# Altium project fotel_color.PrjPCB
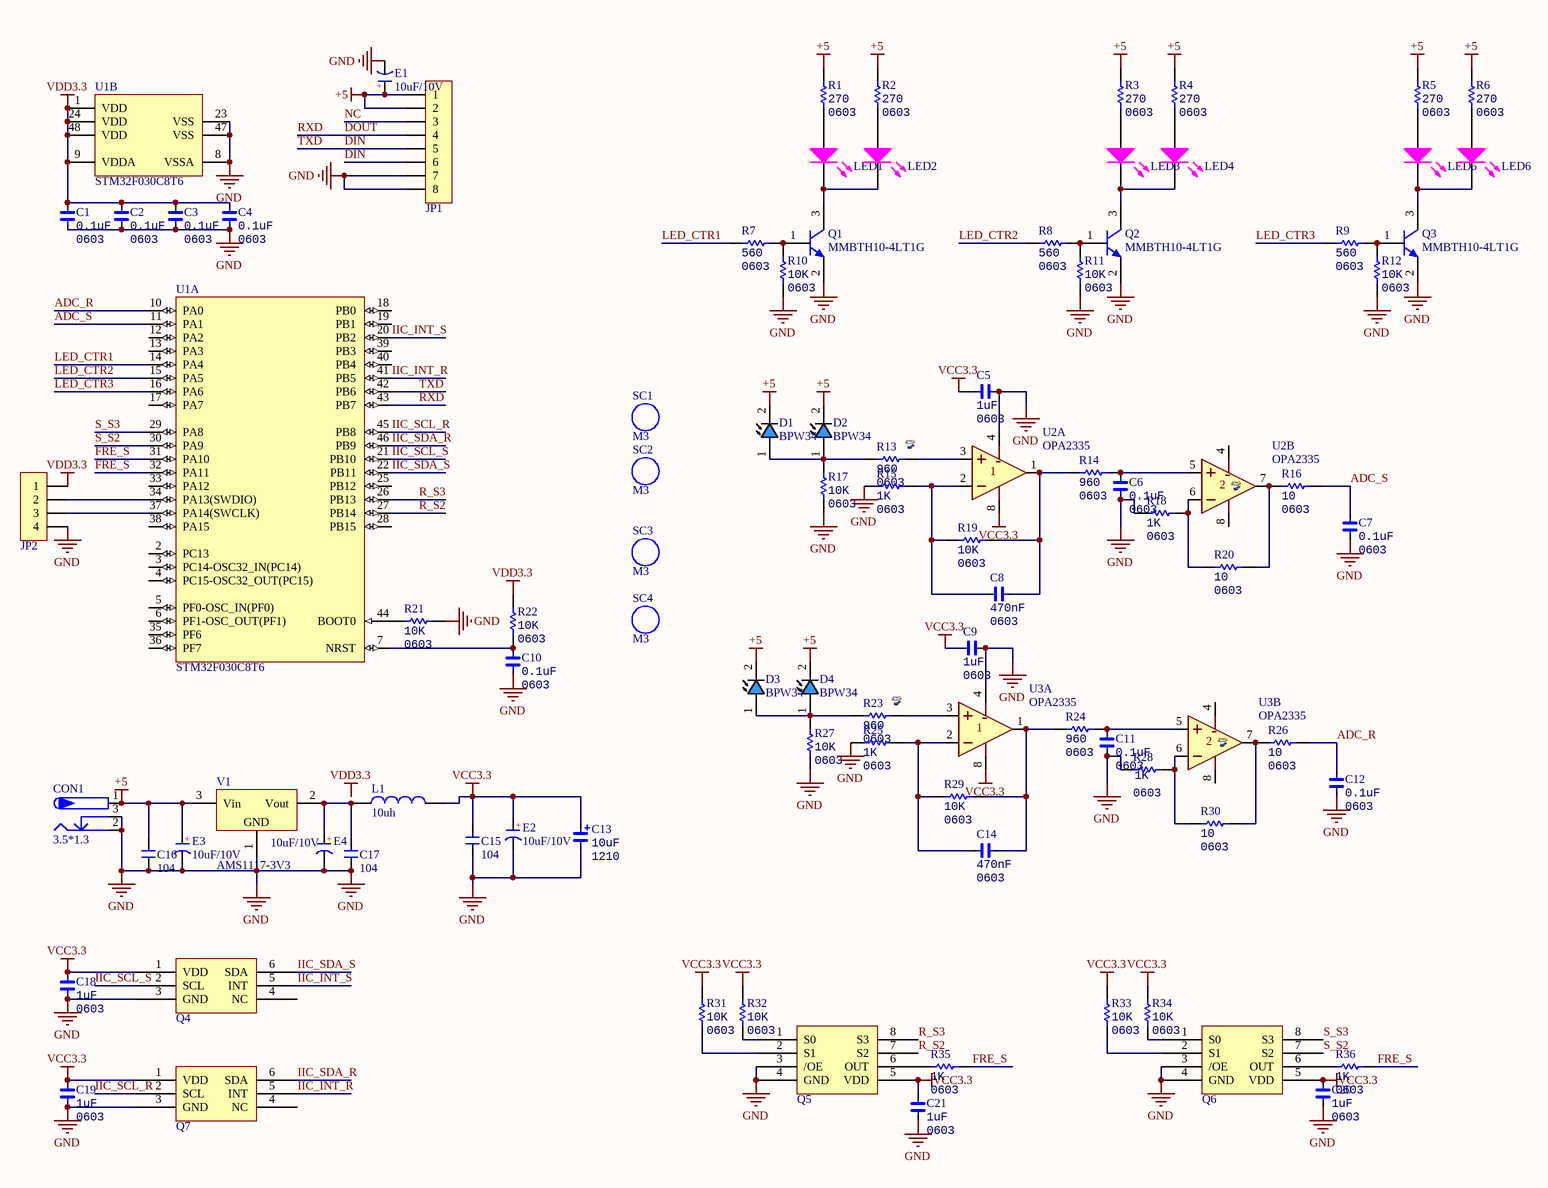
[diagram p0: fotel_color.SchDoc]
1 sheet, 90 parts. Net scope: global (net labels, ports and power ports of the same name join across sheets).
Board file: fotel_color.PcbDoc

## Sheet fotel_color.SchDoc
size A3

### Parts
C1  value 0.1uF  Type: 0603  [CAP_0603]  (hidden comment: C0402)
C2  value 0.1uF  Type: 0603  [CAP_0603]  (hidden comment: C0402)
C3  value 0.1uF  Type: 0603  [CAP_0603]  (hidden comment: C0402)
C4  value 0.1uF  Type: 0603  [CAP_0603]  (hidden comment: C0402)
C5  value 1uF  Type: 0603  [CAP_0603]  (hidden comment: C0402)
C6  value 0.1uF  Type: 0603  [CAP_0603]  (hidden comment: C0402)
C7  value 0.1uF  Type: 0603  [CAP_0603]  (hidden comment: C0402)
C8  value 470nF  Type: 0603  [CAP_0603]  (hidden comment: C0402)
C9  value 1uF  Type: 0603  [CAP_0603]  (hidden comment: C0402)
C10  value 0.1uF  Type: 0603  [CAP_0603]  (hidden comment: C0402)
C11  value 0.1uF  Type: 0603  [CAP_0603]  (hidden comment: C0402)
C12  value 0.1uF  Type: 0603  [CAP_0603]  (hidden comment: C0402)
C13  value 10uF  Type: 1210  [CAP_TAN_B1210]  (hidden comment: C1210)
C14  value 470nF  Type: 0603  [CAP_0603]  (hidden comment: C0402)
C15  104  [C 0603]
C16  104  [C 0603]
C17  104  [C 0603]
C18  value 1uF  Type: 0603  [CAP_0603]  (hidden comment: C0402)
C19  value 1uF  Type: 0603  [CAP_0603]  (hidden comment: C0402)
C20  value 1uF  Type: 0603  [CAP_0603]  (hidden comment: C0402)
C21  value 1uF  Type: 0603  [CAP_0603]  (hidden comment: C0402)
CON1  3.5*1.3  [DC-005]
D1  BPW34  [TEMD5510]
D2  BPW34  [CLS15]
D3  BPW34  [TEMD5510]
D4  BPW34  [CLS15]
E1  10uF/10V  [CM D(6.3*5.4)]
E2  10uF/10V  [CM D(6.3*5.4)]
E3  10uF/10V  [CM D(6.3*5.4)]
E4  10uF/10V  [CM D(6.3*5.4)]
JP1  HDR-1X8  [PH2.0 S-W-8P]  (value not drawn)
JP2  HDR-1X4  [XH2.54-4P]  (value not drawn)
L1  10uh  [L 0603]
LED1  LED-3-R  [LED-R3-H5-SINGLE-R]  (value not drawn)
LED2  LED-3-R  [LED-R3-H5-SINGLE-R]  (value not drawn)
LED3  LED-3-R  [LED-R3-H5-SINGLE-R]  (value not drawn)
LED4  LED-3-R  [LED-R3-H5-SINGLE-R]  (value not drawn)
LED5  LED-3-R  [LED-R3-H5-SINGLE-R]  (value not drawn)
LED6  LED-3-R  [LED-R3-H5-SINGLE-R]  (value not drawn)
Q1  MMBTH10-4LT1G  [ONSC-SOT-23-3-318-08_V]
Q2  MMBTH10-4LT1G  [ONSC-SOT-23-3-318-08_V]
Q3  MMBTH10-4LT1G  [ONSC-SOT-23-3-318-08_V]
Q4  (no value)  [TCS34725]
Q5  (no value)  [SOP-8]
Q6  (no value)  [SOP-8]
Q7  (no value)  [TCS34725]
R1  Type: 0603  [RES_0603]  (hidden comment: 270)
R2  Type: 0603  [RES_0603]  (hidden comment: 270)
R3  Type: 0603  [RES_0603]  (hidden comment: 270)
R4  Type: 0603  [RES_0603]  (hidden comment: 270)
R5  Type: 0603  [RES_0603]  (hidden comment: 270)
R6  Type: 0603  [RES_0603]  (hidden comment: 270)
R7  Type: 0603  [RES_0603]  (hidden comment: 560)
R8  Type: 0603  [RES_0603]  (hidden comment: 560)
R9  Type: 0603  [RES_0603]  (hidden comment: 560)
R10  Type: 0603  [RES_0603]  (hidden comment: 10K)
R11  Type: 0603  [RES_0603]  (hidden comment: 10K)
R12  Type: 0603  [RES_0603]  (hidden comment: 10K)
R13  Type: 0603  [RES_0603]  (hidden comment: 960)
R14  Type: 0603  [RES_0603]  (hidden comment: 960)
R15  Type: 0603  [RES_0603]  (hidden comment: 1K)
R16  Type: 0603  [RES_0603]  (hidden comment: 10)
R17  Type: 0603  [RES_0603]  (hidden comment: 10K)
R18  Type: 0603  [RES_0603]  (hidden comment: 1K)
R19  Type: 0603  [RES_0603]  (hidden comment: 10K)
R20  Type: 0603  [RES_0603]  (hidden comment: 10)
R21  Type: 0603  [RES_0603]  (hidden comment: 10K)
R22  Type: 0603  [RES_0603]  (hidden comment: 10K)
R23  Type: 0603  [RES_0603]  (hidden comment: 960)
R24  Type: 0603  [RES_0603]  (hidden comment: 960)
R25  Type: 0603  [RES_0603]  (hidden comment: 1K)
R26  Type: 0603  [RES_0603]  (hidden comment: 10)
R27  Type: 0603  [RES_0603]  (hidden comment: 10K)
R28  Type: 0603  [RES_0603]  (hidden comment: 1K)
R29  Type: 0603  [RES_0603]  (hidden comment: 10K)
R30  Type: 0603  [RES_0603]  (hidden comment: 10)
R31  Type: 0603  [RES_0603]  (hidden comment: 10K)
R32  Type: 0603  [RES_0603]  (hidden comment: 10K)
R33  Type: 0603  [RES_0603]  (hidden comment: 10K)
R34  Type: 0603  [RES_0603]  (hidden comment: 10K)
R35  Type: 0603  [RES_0603]  (hidden comment: 1K)
R36  Type: 0603  [RES_0603]  (hidden comment: 1K)
SC1  M3  [M3 125X200]
SC2  M3  [M3 125X200]
SC3  M3  [M3 125X200]
SC4  M3  [M3 125X200]
U1  STM32F030C8T6  [LQFP48 7X7_M]  (parts A,B of 2)
U2  OPA2335  [SOG65_8_3]  (parts A,B of 2)
U3  OPA2335  [SOG65_8_3]  (parts A,B of 2)
V1  AMS1117-3V3  [SOT223_L]

### Nets
+5: C16.2 CON1.1 D1.2(CATHODE) D2.2(CATHODE) D3.2(CATHODE) D4.2(CATHODE) E1.1(A) E3.1(A) JP1.1 JP1.2 R1.2 R2.2 R3.2 R4.2 R5.2 R6.2 V1.3(Vin)
GND: C1.2 C2.2 C3.2 C4.2 C5.2 C6.2 C7.2 C9.2 C10.1 C11.2 C12.2 C13.2 C15.1 C16.1 C17.1 C18.2 C19.2 C20.2 C21.2 CON1.2 CON1.3 E1.2(K) E2.2(K) E3.2(K) E4.2(K) JP1.7 JP1.8 JP2.4 Q1.2(E) Q2.2(E) Q3.2(E) Q4.3(GND) Q5.3(/OE) Q5.4(GND) Q6.3(/OE) Q6.4(GND) Q7.3(GND) R10.1 R11.1 R12.1 R15.1 R17.1 R18.1 R21.2 R25.1 R27.1 R28.1 U1.8(VSSA) U1.23(VSS) U1.47(VSS) U2.4(V-) U3.4(V-) V1.1(GND)
VCC3.3: C5.1 C9.1 C13.1 C15.2 C18.1 C19.1 C20.1 C21.1 E2.1(A) L1.2 Q4.1(VDD) Q5.5(VDD) Q6.5(VDD) Q7.1(VDD) R31.2 R32.2 R33.2 R34.2 U2.8(V+) U3.8(V+)
VDD3.3: C1.1 C2.1 C3.1 C4.1 JP2.1 R22.1 U1.1(VDD) U1.9(VDDA) U1.24(VDD) U1.48(VDD)
ADC_R: C12.1 R26.2 U1.10(PA0)
ADC_S: C7.1 R16.2 U1.11(PA1)
DIN: JP1.5 JP1.6 U1.42(PB6)  [also labelled TXD]
DOUT: JP1.4 U1.43(PB7)  [also labelled RXD]
FRE_S: R35.1 R36.1 U1.31(PA10) U1.32(PA11)
IIC_INT_R: Q7.5(INT) U1.41(PB5)
IIC_INT_S: Q4.5(INT) U1.20(PB2)
IIC_SCL_R: Q7.2(SCL) U1.45(PB8)
IIC_SCL_S: Q4.2(SCL) U1.21(PB10)
IIC_SDA_R: Q7.6(SDA) U1.46(PB9)
IIC_SDA_S: Q4.6(SDA) U1.22(PB11)
LED_CTR1: R7.1 U1.14(PA4)
LED_CTR2: R8.1 U1.15(PA5)
LED_CTR3: R9.1 U1.16(PA6)
NC: JP1.3
R_S2: Q5.7(S2) U1.27(PB14)
R_S3: Q5.8(S3) U1.26(PB13)
S_S2: Q6.7(S2) U1.30(PA9)
S_S3: Q6.8(S3) U1.29(PA8)
NetC6_1: C6.1 R14.2 U2.5(IN+)
NetC8_1: C8.1 R14.1 R19.2 U2.1(OUT)
NetC8_2: C8.2 R15.2 R19.1 U2.2(IN-)
NetC10_2: C10.2 R22.2 U1.7(NRST)
NetC11_1: C11.1 R24.2 U3.5(IN+)
NetC14_1: C14.1 R24.1 R29.2 U3.1(OUT)
NetC14_2: C14.2 R25.2 R29.1 U3.2(IN-)
NetC17_2: C17.2 E4.1(A) L1.1 V1.2(Vout)
NetD1_1: D1.1(ANODE) D2.1(ANODE) R13.1 R17.2
NetD3_1: D3.1(ANODE) D4.1(ANODE) R23.1 R27.2
NetJP2_2: JP2.2 U1.34(PA13(SWDIO))
NetJP2_3: JP2.3 U1.37(PA14(SWCLK))
NetLED1_1: LED1.1(A) R1.1
NetLED1_2: LED1.2(K) LED2.2(K) Q1.3(C)
NetLED2_1: LED2.1(A) R2.1
NetLED3_1: LED3.1(A) R3.1
NetLED3_2: LED3.2(K) LED4.2(K) Q2.3(C)
NetLED4_1: LED4.1(A) R4.1
NetLED5_1: LED5.1(A) R5.1
NetLED5_2: LED5.2(K) LED6.2(K) Q3.3(C)
NetLED6_1: LED6.1(A) R6.1
NetQ1_1: Q1.1(B) R7.2 R10.2
NetQ2_1: Q2.1(B) R8.2 R11.2
NetQ3_1: Q3.1(B) R9.2 R12.2
NetQ5_1: Q5.1(S0) R32.1
NetQ5_2: Q5.2(S1) R31.1
NetQ5_6: Q5.6(OUT) R35.2
NetQ6_1: Q6.1(S0) R34.1
NetQ6_2: Q6.2(S1) R33.1
NetQ6_6: Q6.6(OUT) R36.2
NetR13_2: R13.2 U2.3(IN+)
NetR16_1: R16.1 R20.2 U2.7(OUT)
NetR18_2: R18.2 R20.1 U2.6(IN-)
NetR21_1: R21.1 U1.44(BOOT0)
NetR23_2: R23.2 U3.3(IN+)
NetR26_1: R26.1 R30.2 U3.7(OUT)
NetR28_2: R28.2 R30.1 U3.6(IN-)

Not connected (* = marked no-connect by the designer): Q4 4(NC); Q7 4(NC); U1 2(PC13) 3(PC14-OSC32_IN(PC14)) 4(PC15-OSC32_OUT(PC15)) 5(PF0-OSC_IN(PF0)) 6(PF1-OSC_OUT(PF1)) 12(PA2) 13(PA3) 17(PA7) 18(PB0) 19(PB1) 25(PB12) 28(PB15) 33(PA12) 35(PF6) 36(PF7) 38(PA15) 39(PB3) 40(PB4)

### Notes on the sheet
- Labels drawn without touching a wire or pin: VDD3.3
- (in symbol C-CM) +

### Library data of the parts
C1-C12 C14 C18-C21 = Cap_0603: Capacitor; Specification: X7R 50V; Manufacturer: *
C13 = Cap_Tan_1210: Capacitor Tantalum; Specification: X5R 10V; Manufacturer: *
C15-C17 = C: 无极性贴片电容; 版权归属: 黎明电子style; BOM名称: 无极性贴片电容; 学习资源: https://lmdzstyle.taobao.com/
CON1 = P-DC: 低压电源接口; BOM名称: DC电源接口; 版权归属: 黎明电子style; 学习资源: https://lmdzstyle.taobao.com/
D1-D4 = PHDIODE_BPW34S: Photodiode, 2nA, 32Vr, 20ns, 60deg, 850nm; MANF: OSRAM, VISHAY; MANF_P#: BPW34BS, BPW34S; PARAM2: 60deg, 850nm; PARAM: 2nA, 32Vr, 20ns; PRICE: $1; Value: BPW34
E1-E4 = C-CM: 贴片电解电容; 版权归属: 黎明电子style; BOM名称: 贴片电解电容; 学习资源: https://lmdzstyle.taobao.com/
JP1 = Header 8: 8P接插件; 版权归属: 黎明电子style; BOM名称: 8P接插件; 学习资源: https://lmdzstyle.taobao.com/
JP2 = Header 4: 4P接插件; 版权归属: 黎明电子style; BOM名称: 4P接插件; 学习资源: https://lmdzstyle.taobao.com/
L1 = L: 小功率贴片电感; 版权归属: 黎明电子style; BOM名称: 小功率贴片电感; 学习资源: https://lmdzstyle.taobao.com/
LED1-LED6 = LED-3-R: Typical INFRARED GaAs LED; Published: 8-Jun-2000; Revision: July-2002: Re-released for DXP Platform.; Publisher: Altium Limited
Q1-Q3 = MMBTH10-4LT1G: VHF / UHF Transistor, NPN Silicon, 3-Pin SOT-23, Pb-Free, Tape and Reel; Manufacturer: On Semiconductor; fT Min (MHz): 800; DatasheetVersion: Rev. 5; PackageVersion: Rev. AP, 11/2009; PackageReference: SOT-23-3-318-08; PackageDescription: 3-Pin Small Outline Transistor, Body 2.92 x 1.3 mm, Pitch 0.95 mm; Supplier 1: Digi-Key; Supplier Part Number 1: MMBTH10-4LT1GOSTR-ND; Supplier 2: Digi-Key; Supplier Part Number 2: MMBTH10-4LT1GOSCT-ND; Supplier 3: Digi-Key; Supplier Part Number 3: MMBTH10-4LT1GOSDKR-ND; Supplier 4: Newark; Supplier Part Number 4: 26K4540; Supplier 5: Mouser; Supplier Part Number 5: 863-MMBTH10-4LT1G; Packing: Tape and Reel; Polarity: NPN; RoHS: TRUE; Mounting Technology: Surface Mount; PartNumber: MMBTH10-4LT1G; ComponentLink1Description: Manufacturer URL; ComponentLink1URL: http://www.onsemi.com/; ComponentLink2Description: Datasheet; ComponentLink2URL: http://www.onsemi.cn/pub_link/Collateral/MMBTH10LT1-D.PDF; ComponentLink3Description: Package Specification; ComponentLink3URL: http://www.onsemi.cn/pub_link/Collateral/318-08.PDF
Q4 Q7 = TCS34725: Phototransistor,IIC
Q5 Q6 = TCS3200: Phototransistor,digit
R1-R36 = Res_0603: Resistor; Specification: ±5%; Manufacturer: *
  R1-R6: Value: 270
  R7-R9: Value: 560
  R10-R12 R17 R19 R21 R22 R27 R29 R31-R34: Value: 10K
  R13 R14 R23 R24: Value: 960
  R15 R18 R25 R28 R35 R36: Value: 1K
  R16 R20 R26 R30: Value: 10
SC1-SC4 = M3: 铜柱孔; 版权归属: 黎明电子style; BOM名称: 铜柱孔; 学习资源: https://lmdzstyle.taobao.com/
U1 = STM32F030C8T6: ARM Cortex-M0 32-bit MCU, 64 KB Flash, 8 KB Internal RAM, 39 I/Os, 48-pin LQFP, -40 to 85 degC, Tray; FLASH Size (Prog) (kB): 64; I/Os (High Current): 39; Internal RAM Size (kB): 8; Operating Frequency(F) (Processor speed) (MHz): 48; Supply Voltage(Vcc) min (V): 2.4; DatasheetVersion: Rev. 1; PackageVersion: Rev. 6, 06/2013; PackageReference: LQFP48; PackageDescription: 48-Pin Low Profile Quad Flat Package, 7 x 7 mm Body, 0.5 mm Pitch; Supplier 1: Digi-Key; Supplier Part Number 1: 497-14043-ND; Supplier 2: Newark; Supplier Part Number 2: 06X3647; Supplier 3: Mouser; Supplier Part Number 3: 511-STM32F030C8T6; Core: ARM Cortex-M0; Packing: Tray; Mounting Technology: Surface Mount; PartNumber: STM32F030C8T6; ComponentLink1Description: Manufacturer URL; ComponentLink1URL: http://www.st.com/web/en/home.html; ComponentLink2Description: Datasheet; ComponentLink2URL: http://www.st.com/st-web-ui/static/active/en/resource/technical/document/datasheet/DM00088500.pdf; ComponentLink3Description: Package Specification; ComponentLink3URL: http://www.st.com/st-web-ui/static/active/en/resource/technical/document/datasheet/DM00058181.pdf
U2 U3 = OPA2335_SSOP8: AMP, Low Offset, Zero Drift, Single-Supply; MANF: Texas Instruments; MANF_P#: OPA2335AIDGK; PARAM2: 2.7~5.5V, ±1.35~±2.75V; PARAM: 0.05uV/°C Drift, 5uV Offset, -40~125°C; PRICE: 5$; VALUE: OPA2335
V1 = AMS1117: 三端稳压芯片; BOM名称: 稳压芯片; 版权归属: 黎明电子style; 学习资源: https://lmdzstyle.taobao.com/